# Altium schematic sheet VESC_KS75600_ana_con.SchDoc
size A2; SheetNumber: 1; SheetTotal: 4
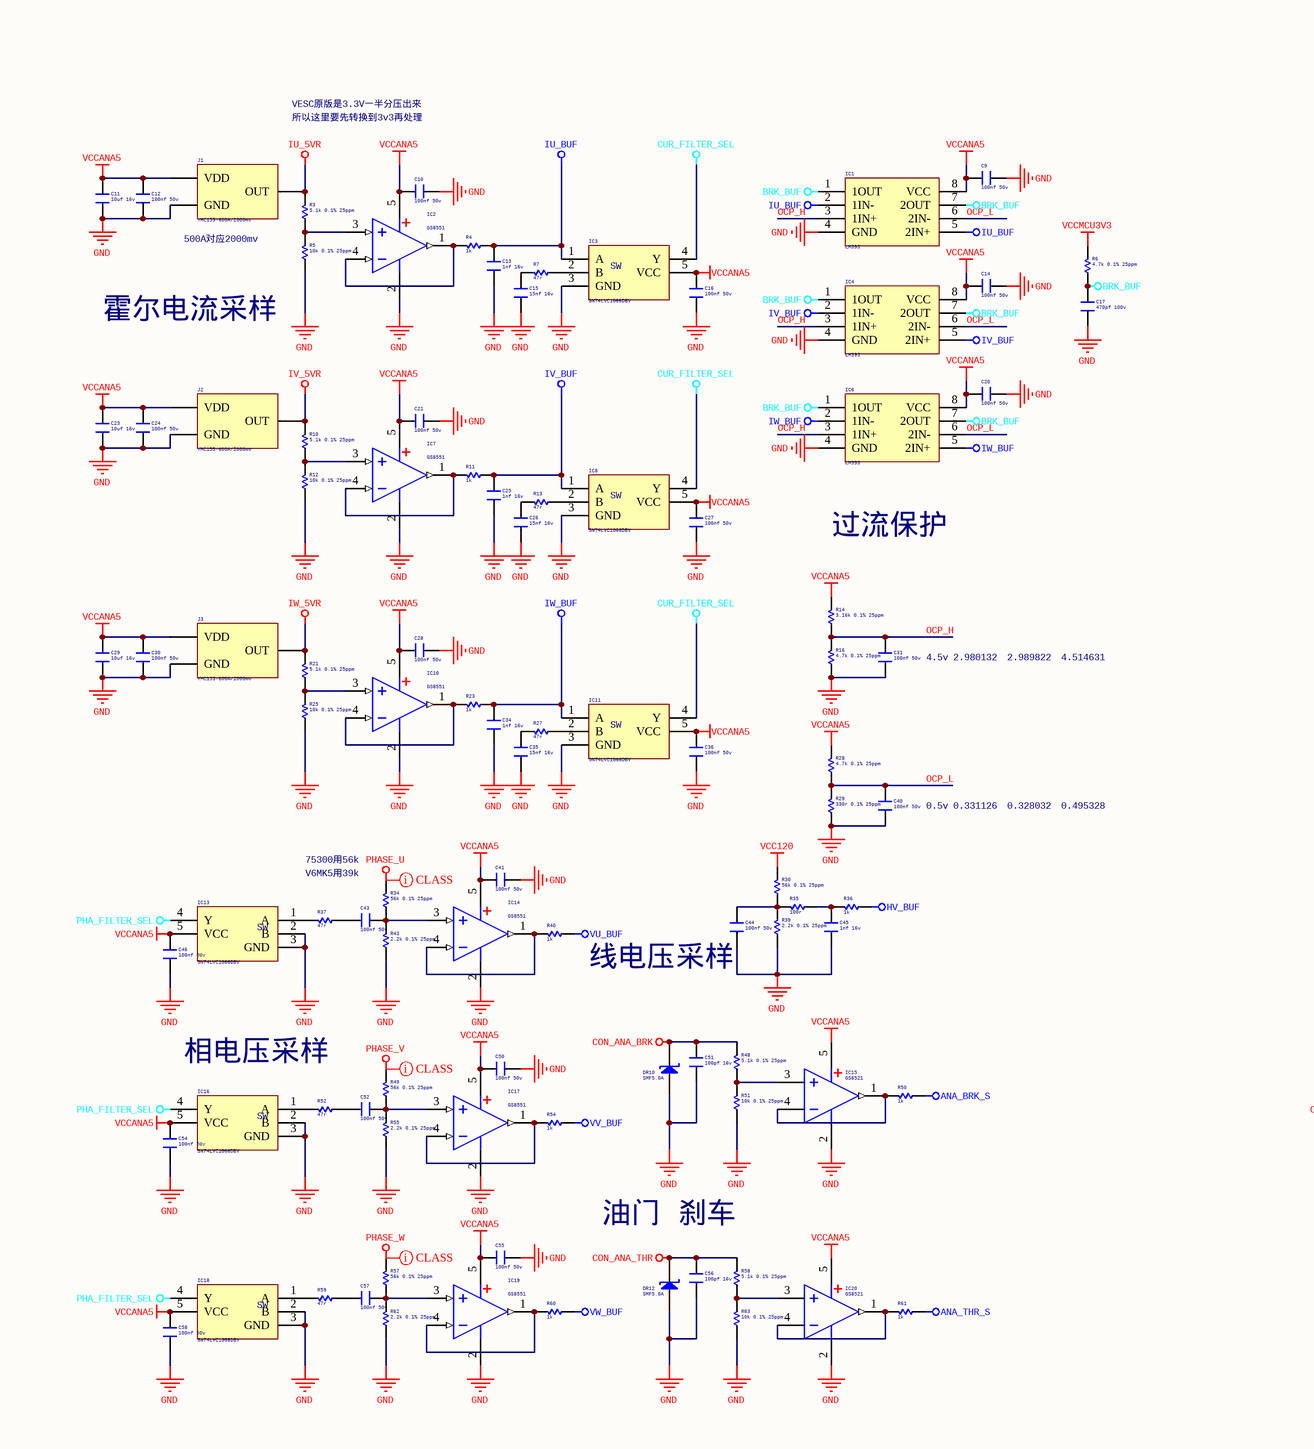
[diagram p0: VESC_KS75600_ana_con.SchDoc, left]
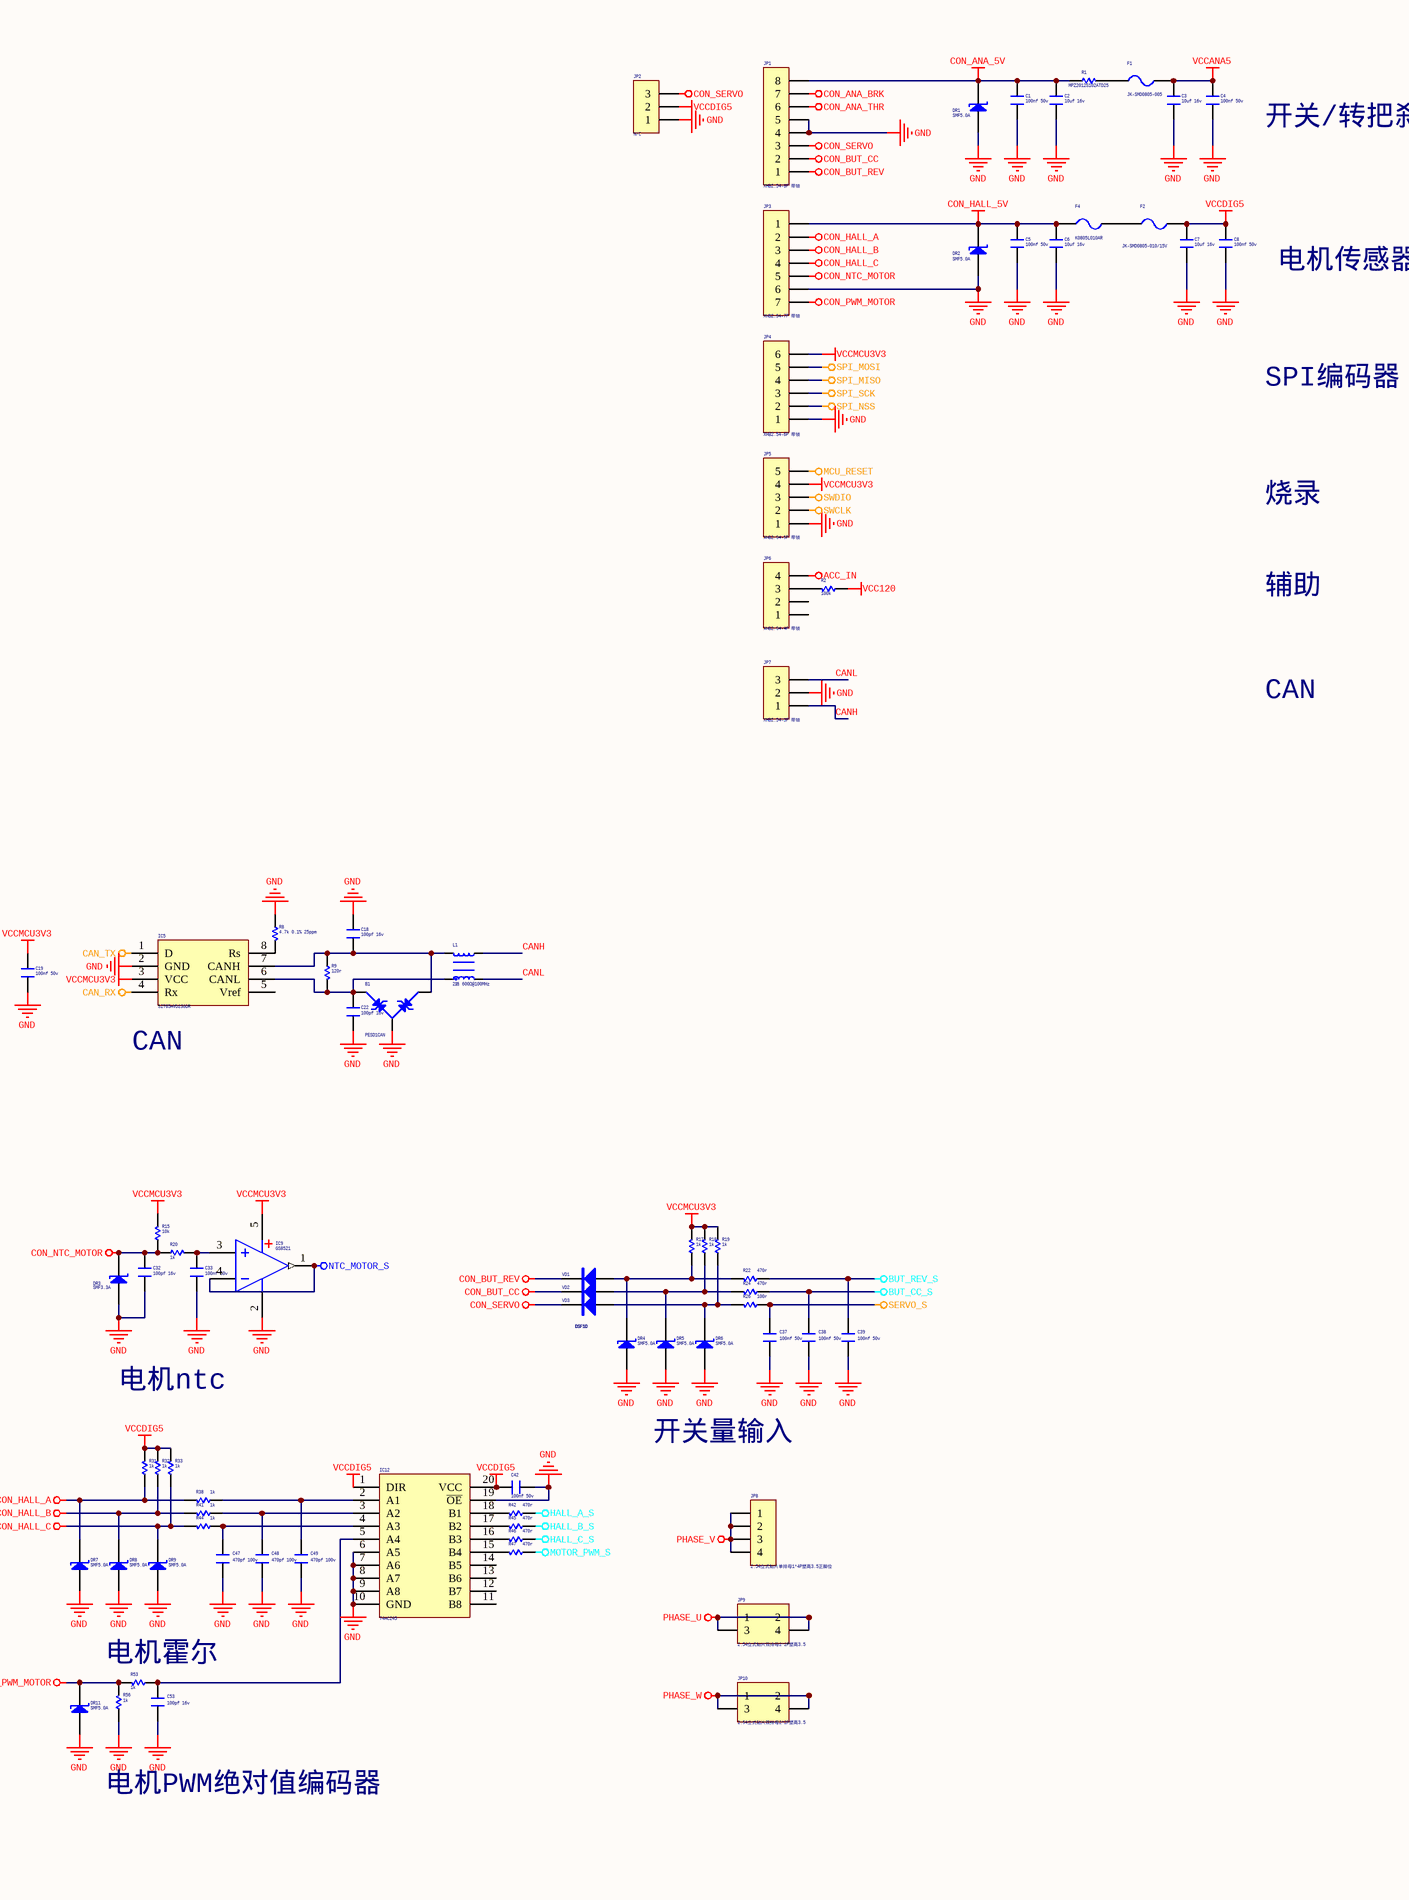
[diagram p1: VESC_KS75600_ana_con.SchDoc, right]

## Parts
B1  PESD1CAN  [SOT23-3L]
C1  100nf 50v  [C 0603]
C2  10uf 16v  [C 0805]
C3  10uf 16v  [C 0805]
C4  100nf 50v  [C 0603]
C5  100nf 50v  [C 0603]
C6  10uf 16v  [C 0805]
C7  10uf 16v  [C 0805]
C8  100nf 50v  [C 0603]
C9  100nf 50v  [C 0603]
C10  100nf 50v  [C 0603]
C11  10uf 16v  [C 0805]
C12  100nf 50v  [C 0603]
C13  1nf 16v  [C 0603]
C14  100nf 50v  [C 0603]
C15  15nf 16v  [C 0603]
C16  100nf 50v  [C 0603]
C17  470pf 100v  [C 0805]
C18  100pf 16v  [C 0603]
C19  100nf 50v  [C 0603]
C20  100nf 50v  [C 0603]
C21  100nf 50v  [C 0603]
C22  100pf 16v  [C 0603]
C23  10uf 16v  [C 0805]
C24  100nf 50v  [C 0603]
C25  1nf 16v  [C 0603]
C26  15nf 16v  [C 0603]
C27  100nf 50v  [C 0603]
C28  100nf 50v  [C 0603]
C29  10uf 16v  [C 0805]
C30  100nf 50v  [C 0603]
C31  100nf 50v  [C 0603]
C32  100pf 16v  [C 0603]
C33  100nf 50v  [C 0603]
C34  1nf 16v  [C 0603]
C35  15nf 16v  [C 0603]
C36  100nf 50v  [C 0603]
C37  100nf 50v  [C 0805]
C38  100nf 50v  [C 0805]
C39  100nf 50v  [C 0805]
C40  100nf 50v  [C 0603]
C41  100nf 50v  [C 0603]
C42  100nf 50v  [C 0603]
C43  100nf 50v  [C 0805]
C44  100nf 50v  [C 0805]
C45  1nf 16v  [C 0603]
C46  100nf 50v  [C 0603]
C47  470pf 100v  [C 0805]
C48  470pf 100v  [C 0805]
C49  470pf 100v  [C 0805]
C50  100nf 50v  [C 0603]
C51  100pf 16v  [C 0603]
C52  100nf 50v  [C 0805]
C53  100pf 16v  [C 0805]
C54  100nf 50v  [C 0603]
C55  100nf 50v  [C 0603]
C56  100pf 16v  [C 0603]
C57  100nf 50v  [C 0805]
C58  100nf 50v  [C 0603]
DR1  SMF5.0A  [SOD-123F]
DR2  SMF5.0A  [SOD-123F]
DR3  SMF3.3A  [SOD-123F]
DR4  SMF5.0A  [SOD-123F]
DR5  SMF5.0A  [SOD-123F]
DR6  SMF5.0A  [SOD-123F]
DR7  SMF5.0A  [SOD-123F]
DR8  SMF5.0A  [SOD-123F]
DR9  SMF5.0A  [SOD-123F]
DR10  SMF5.0A  [SOD-123F]
DR11  SMF5.0A  [SOD-123F]
DR12  SMF5.0A  [SOD-123F]
F1  JK-SMD0805-005  [FU 0805]
F2  JK-SMD0805-010/15V  [FU 0805]
F4  K0805L010AR  [FU 0805]
IC1  LM393  [SOP8_N]
IC2  GS8551  [SOT23-5L]
IC3  SN74LVC1G66DBV  [SOT23-5N]
IC4  LM393  [SOP8_N]
IC5  SIT65HVD230DR  [SOP8_N]
IC6  LM393  [SOP8_N]
IC7  GS8551  [SOT23-5L]
IC8  SN74LVC1G66DBV  [SOT23-5N]
IC9  GS8521  [SOT23-5N]
IC10  GS8551  [SOT23-5L]
IC11  SN74LVC1G66DBV  [SOT23-5N]
IC12  74HC245  [TSSOP20_N]
IC13  SN74LVC1G66DBV  [SOT23-5N]
IC14  GS8551  [SOT23-5L]
IC15  GS8521  [SOT23-5N]
IC16  SN74LVC1G66DBV  [SOT23-5N]
IC17  GS8551  [SOT23-5L]
IC18  SN74LVC1G66DBV  [SOT23-5N]
IC19  GS8551  [SOT23-5L]
IC20  GS8521  [SOT23-5N]
J1  YMC15S-600A/2000mv  [YMC15S]
J2  YMC15S-600A/2000mv  [YMC15S]
J3  YMC15S-600A/2000mv  [YMC15S]
JP1  XHB2.54-8P 带锁  [XH2.54-8P]
JP2  N/C  [HDR-1X3]
JP3  XHB2.54-7P 带锁  [XH2.54-7P]
JP4  XHB2.54-6P 带锁  [XH2.54-6P]
JP5  XHB2.54-5P 带锁  [XH2.54-5P]
JP6  XHB2.54-4P 带锁  [XH2.54-4P]
JP7  XHB2.54-3P 带锁  [XH2.54-3P]
JP8  2.54立式贴片单排母1*4P塑高3.5正脚位  [2.54立贴错位排母 4P]
JP9  2.54立式贴片双排母2*2P塑高3.5  [贴片2.54双排母 pcb开孔]
JP10  2.54立式贴片双排母2*2P塑高3.5  [贴片2.54双排母 pcb开孔]
L1  2路 600Ω@100MHz  [D_C_C_1206]
R1  MPZ2012S102ATD25  [R 0805]
R2  100k  [R 0805]
R3  5.1k 0.1% 25ppm  [R 0805-HP]
R4  1k  [R 0603]
R5  10k 0.1% 25ppm  [R 0805-HP]
R6  4.7k 0.1% 25ppm  [R 0805]
R7  47r  [R 0603]
R8  4.7k 0.1% 25ppm  [R 0805]
R9  120r  [R 0603]
R10  5.1k 0.1% 25ppm  [R 0805-HP]
R11  1k  [R 0603]
R12  10k 0.1% 25ppm  [R 0805-HP]
R13  47r  [R 0603]
R14  3.16k 0.1% 25ppm  [R 0805-HP]
R15  10k  [R 0603]
R16  4.7k 0.1% 25ppm  [R 0805]
R17  1k  [R 0603]
R18  1k  [R 0603]
R19  1k  [R 0603]
R20  1k  [R 0603]
R21  5.1k 0.1% 25ppm  [R 0805-HP]
R22  470r  [R 0603]
R23  1k  [R 0603]
R24  470r  [R 0603]
R25  10k 0.1% 25ppm  [R 0805-HP]
R26  100r  [R 0603]
R27  47r  [R 0603]
R28  4.7k 0.1% 25ppm  [R 0805]
R29  330r 0.1% 25ppm  [R 0805-HP]
R30  56k 0.1% 25ppm  [R 0805-HP]
R31  1k  [R 0603]
R32  1k  [R 0603]
R33  1k  [R 0603]
R34  56k 0.1% 25ppm  [R 0805-HP]
R35  100r  [R 0603]
R36  1k  [R 0603]
R37  47r  [R 0603]
R38  1k  [R 0603]
R39  2.2k 0.1% 25ppm  [R 0805-HP]
R40  1k  [R 0603]
R41  1k  [R 0603]
R42  470r  [R 0603]
R43  2.2k 0.1% 25ppm  [R 0805-HP]
R44  1k  [R 0603]
R45  470r  [R 0603]
R46  470r  [R 0603]
R47  470r  [R 0603]
R48  5.1k 0.1% 25ppm  [R 0805-HP]
R49  56k 0.1% 25ppm  [R 0805-HP]
R50  1k  [R 0603]
R51  10k 0.1% 25ppm  [R 0805-HP]
R52  47r  [R 0603]
R53  1k  [R 0603]
R54  1k  [R 0603]
R55  2.2k 0.1% 25ppm  [R 0805-HP]
R56  1k  [R 0603]
R57  56k 0.1% 25ppm  [R 0805-HP]
R58  5.1k 0.1% 25ppm  [R 0805-HP]
R59  47r  [R 0603]
R60  1k  [R 0603]
R61  1k  [R 0603]
R62  2.2k 0.1% 25ppm  [R 0805-HP]
R63  10k 0.1% 25ppm  [R 0805-HP]
VD1  DSF1D  [SOD-123]
VD2  DSF1D  [SOD-123]
VD3  DSF1D  [SOD-123]

## Nets
ACC_IN: JP6.4
ANA_BRK_S: R50.1
ANA_THR_S: R61.1
BRK_BUF: C17.1 IC1.1(1OUT) IC1.7(2OUT) IC4.1(1OUT) IC4.7(2OUT) IC6.1(1OUT) IC6.7(2OUT) R6.1
BUT_CC_S: C38.2 R24.1
BUT_REV_S: C39.2 R22.1
CAN_RX: IC5.4(Rx)
CAN_TX: IC5.1(D)
CON_ANA_5V: C1.1 C2.1 DR1.2(K) JP1.8 R1.1
CON_ANA_BRK: C51.2 DR10.2(K) JP1.7 R48.2
CON_ANA_THR: C56.2 DR12.2(K) JP1.6 R58.2
CON_BUT_CC: JP1.2 VD2.2(K)
CON_BUT_REV: JP1.1 VD1.2(K)
CON_HALL_5V: C5.1 C6.1 DR2.2(K) F4.2 JP3.1
CON_HALL_A: DR7.2(K) JP3.2 R31.1 R38.2
CON_HALL_B: DR8.2(K) JP3.3 R32.1 R41.2
CON_HALL_C: DR9.2(K) JP3.4 R33.1 R44.2
CON_NTC_MOTOR: C32.2 DR3.2(K) JP3.5 R15.1 R20.1
CON_PWM_MOTOR: DR11.2(K) JP3.7 R53.2 R56.2
CON_SERVO: JP1.3 JP2.3 VD3.2(K)
CUR_FILTER_SEL: IC3.4(Y) IC8.4(Y) IC11.4(Y)
GND: B1.3 C1.2 C2.2 C3.2 C4.2 C5.2 C6.2 C7.2 C8.2 C9.2 C10.2 C11.1 C12.2 C13.2 C14.2 C15.2 C16.2 C17.2 C18.2 C19.2 C20.2 C21.2 C22.1 C23.1 C24.2 C25.2 C26.2 C27.2 C28.2 C29.1 C30.2 C31.1 C32.1 C33.1 C34.2 C35.2 C36.2 C37.1 C38.1 C39.1 C40.1 C41.2 C42.2 C44.2 C45.2 C46.2 C47.1 C48.1 C49.1 C50.2 C51.1 C53.1 C54.2 C55.2 C56.1 C58.2 DR1.1(A) DR2.1(A) DR3.1(A) DR4.1(A) DR5.1(A) DR6.1(A) DR7.1(A) DR8.1(A) DR9.1(A) DR10.1(A) DR11.1(A) DR12.1(A) IC1.4(GND) IC2.2(V-) IC3.3(GND) IC4.4(GND) IC5.2(GND) IC6.4(GND) IC7.2(V-) IC8.3(GND) IC9.2(V-) IC10.2(V-) IC11.3(GND) IC12.6(A5) IC12.7(A6) IC12.8(A7) IC12.9(A8) IC12.10(GND) IC12.19(~{OE}) IC13.2(B) IC13.3(GND) IC14.2(V-) IC15.2(V-) IC16.2(B) IC16.3(GND) IC17.2(V-) IC18.2(B) IC18.3(GND) IC19.2(V-) IC20.2(V-) J1.2(GND) J2.2(GND) J3.2(GND) JP1.4 JP1.5 JP2.1 JP3.6 JP4.1 JP5.1 JP7.2 R5.1 R8.1 R12.1 R16.1 R25.1 R29.1 R39.1 R43.1 R51.1 R55.1 R56.1 R62.1 R63.1
HALL_A_S: R42.1
HALL_B_S: R45.1
HALL_C_S: R46.1
HV_BUF: R36.1
IU_5VR: J1.3(OUT) R3.2
IU_BUF: C13.1 IC1.2(1IN-) IC1.5(2IN+) IC3.1(A) R4.1
IV_5VR: J2.3(OUT) R10.2
IV_BUF: C25.1 IC4.2(1IN-) IC4.5(2IN+) IC8.1(A) R11.1
IW_5VR: J3.3(OUT) R21.2
IW_BUF: C34.1 IC6.2(1IN-) IC6.5(2IN+) IC11.1(A) R23.1
MCU_RESET: JP5.5
MOTOR_PWM_S: R47.1
NTC_MOTOR_S: IC9.1(OUT) IC9.4(IN-)
PHA_FILTER_SEL: IC13.4(Y) IC16.4(Y) IC18.4(Y)
PHASE_U: JP9.1 JP9.2 JP9.3 JP9.4 R34.2
PHASE_V: JP8.1 JP8.2 JP8.3 JP8.4 R49.2
PHASE_W: JP10.1 JP10.2 JP10.3 JP10.4 R57.2
SERVO_S: C37.2 R26.1
SPI_MISO: JP4.4
SPI_MOSI: JP4.5
SPI_NSS: JP4.2
SPI_SCK: JP4.3
SWCLK: JP5.2
SWDIO: JP5.3
VCC120: R2.1 R30.2
VCCANA5: C3.1 C4.1 C9.1 C10.1 C11.2 C12.1 C14.1 C16.1 C20.1 C21.1 C23.2 C24.1 C27.1 C28.1 C29.2 C30.1 C36.1 C41.1 C46.1 C50.1 C54.1 C55.1 C58.1 F1.1 IC1.8(VCC) IC2.5(V+) IC3.5(VCC) IC4.8(VCC) IC6.8(VCC) IC7.5(V+) IC8.5(VCC) IC10.5(V+) IC11.5(VCC) IC13.5(VCC) IC14.5(V+) IC15.5(V+) IC16.5(VCC) IC17.5(V+) IC18.5(VCC) IC19.5(V+) IC20.5(V+) J1.1(VDD) J2.1(VDD) J3.1(VDD) R14.2 R28.2
VCCDIG5: C7.1 C8.1 C42.1 F2.1 IC12.1(DIR) IC12.20(VCC) JP2.2 R31.2 R32.2 R33.2
VCCMCU3V3: C19.1 IC5.3(VCC) IC9.5(V+) JP4.6 JP5.4 R6.2 R15.2 R17.2 R18.2 R19.2
VU_BUF: R40.1
VV_BUF: R54.1
VW_BUF: R60.1
CANH: JP7.1 L1.3
CANL: JP7.3 L1.2
OCP_H: C31.2 IC1.3(1IN+) IC4.3(1IN+) IC6.3(1IN+) R14.1 R16.2
OCP_L: C40.2 IC1.6(2IN-) IC4.6(2IN-) IC6.6(2IN-) R28.1 R29.2
NetB1_1: B1.1 C18.1 IC5.7(CANH) L1.4 R9.1
NetB1_2: B1.2 C22.2 IC5.6(CANL) L1.1 R9.2
NetC15_1: C15.1 R7.2
NetC26_1: C26.1 R13.2
NetC33_2: C33.2 IC9.3(IN+) R20.2
NetC35_1: C35.1 R27.2
NetC43_1: C43.1 R37.1
NetC43_2: C43.2 IC14.3(IN+) R34.1 R43.2
NetC44_1: C44.1 R30.1 R35.2 R39.2
NetC45_1: C45.1 R35.1 R36.2
NetC47_2: C47.2 IC12.4(A3) R44.1
NetC48_2: C48.2 IC12.3(A2) R41.1
NetC49_2: C49.2 IC12.2(A1) R38.1
NetC52_1: C52.1 R52.1
NetC52_2: C52.2 IC17.3(IN+) R49.1 R55.2
NetC53_2: C53.2 IC12.5(A4) R53.1
NetC57_1: C57.1 R59.1
NetC57_2: C57.2 IC19.3(IN+) R57.1 R62.2
NetDR4_2: DR4.2(K) R17.1 R22.2 VD1.1(A)
NetDR5_2: DR5.2(K) R18.1 R24.2 VD2.1(A)
NetDR6_2: DR6.2(K) R19.1 R26.2 VD3.1(A)
NetF1_2: F1.2 R1.2
NetF2_2: F2.2 F4.1
NetIC2_1: IC2.1(OUT) IC2.4(IN-) R4.2
NetIC2_3: IC2.3(IN+) R3.1 R5.2
NetIC3_2: IC3.2(B) R7.1
NetIC5_8: IC5.8(Rs) R8.2
NetIC7_1: IC7.1(OUT) IC7.4(IN-) R11.2
NetIC7_3: IC7.3(IN+) R10.1 R12.2
NetIC8_2: IC8.2(B) R13.1
NetIC10_1: IC10.1(OUT) IC10.4(IN-) R23.2
NetIC10_3: IC10.3(IN+) R21.1 R25.2
NetIC11_2: IC11.2(B) R27.1
NetIC12_15: IC12.15(B4) R47.2
NetIC12_16: IC12.16(B3) R46.2
NetIC12_17: IC12.17(B2) R45.2
NetIC12_18: IC12.18(B1) R42.2
NetIC13_1: IC13.1(A) R37.2
NetIC14_1: IC14.1(OUT) IC14.4(IN-) R40.2
NetIC15_1: IC15.1(OUT) IC15.4(IN-) R50.2
NetIC15_3: IC15.3(IN+) R48.1 R51.2
NetIC16_1: IC16.1(A) R52.2
NetIC17_1: IC17.1(OUT) IC17.4(IN-) R54.2
NetIC18_1: IC18.1(A) R59.2
NetIC19_1: IC19.1(OUT) IC19.4(IN-) R60.2
NetIC20_1: IC20.1(OUT) IC20.4(IN-) R61.2
NetIC20_3: IC20.3(IN+) R58.1 R63.2
NetJP6_3: JP6.3 R2.2

Not connected (* = marked no-connect by the designer): IC5 5(Vref); IC12 11(B8) 12(B7) 13(B6) 14(B5); JP6 1 2

## Layout directives
net class 相线: PHASE_U, PHASE_V, PHASE_W

## Notes on the sheet
- 开关/转把刹车
- 电机传感器
- SPI编码器
- 烧录
- 辅助
- VESC原版是3.3V一半分压出来
- 所以这里要先转换到3v3再处理
- CAN
- (near J1) 500A对应2000mv
- 霍尔电流采样
- (near IC5) CAN
- 过流保护
- (near C31) 4.5v
- 2.980132
- 2.989822
- 4.514631
- (near C40) 0.5v
- 0.331126
- 0.328032
- 0.495328
- 电机ntc
- 75300用56k
- V6MK5用39k
- 开关量输入
- (near R40) 线电压采样
- (near IC16) 相电压采样
- (near R53) 电机霍尔
- 油门 刹车
- 电机PWM绝对值编码器
- (in symbol SN74LVC1G66) SW

## Library data of the parts
B1 = SM712: 7V+12V 双向双路TVS
C1-C58 = C: 无极性贴片电容
  C1 C4 C5 C8-C10 C12 C14 C16 C19-C21 C24 C27 C28 C30 C31 C33 C36-C44 C46 C50 C52 C54 C55 C57 C58: Voltage: 50v; Value: 100nf
  C2 C3 C6 C7 C11 C23 C29: Voltage: 16v; Value: 10uf
  C13 C25 C34 C45: Voltage: 16v; Value: 1nf
  C15 C26 C35: Voltage: 16v; Value: 15nf
  C17 C47-C49: Voltage: 100v; Value: 470pf
  C18 C22 C32 C51 C53 C56: Voltage: 16v; Value: 100pf
DR1-DR12 = DR_S: 瞬态电压抑制二极管(单向)
F1 F2 F4 = FU: 贴片保险丝
IC1 IC4 IC6 = LM393_A: 双路电压比较
IC2 IC7 IC9 IC10 IC14 IC15 IC17 IC19 IC20 = GS8331: 单运放 SOT23-5
IC3 IC8 IC11 IC13 IC16 IC18 = SN74LVC1G66: 单路常开模拟开关 0.5ns 5.5Ω
IC5 = SN65HVD230: CAN芯片
IC12 = 74HC245: 八线收发器
J1-J3 = YMC15S: 源弥科技 开环霍尔传感器
JP1 = Header 8: 8P接插件
JP2 JP7 = Header 3: 3P接插件
JP3 = Header 7: 7P接插件
JP4 = Header 6: 6P接插件
JP5 = Header 5: 5P接插件
JP6 JP8 = Header 4: 4P接插件
JP9 JP10 = Header 2X2: 2*2P接插件
L1 = L-CMC: 共模电感; Value: 2路 600Ω@100MHz
R1-R63 = R: 贴片电阻
  R1: Value: MPZ2012S102ATD25
  R2: Value: 100k
  R3 R10 R21 R48 R58: Value: 5.1k 0.1% 25ppm
  R4 R11 R17-R20 R23 R31-R33 R36 R38 R40 R41 R44 R50 R53 R54 R56 R60 R61: Value: 1k
  R5 R12 R25 R51 R63: Value: 10k 0.1% 25ppm
  R6 R8 R16 R28: Value: 4.7k 0.1% 25ppm
  R7 R13 R27 R37 R52 R59: Value: 47r
  R9: Value: 120r
  R14: Value: 3.16k 0.1% 25ppm
  R15: Value: 10k
  R22 R24 R42 R45-R47: Value: 470r
  R26 R35: Value: 100r
  R29: Value: 330r 0.1% 25ppm
  R30 R34 R49 R57: Value: 56k 0.1% 25ppm
  R39 R43 R55 R62: Value: 2.2k 0.1% 25ppm
VD1-VD3 = SR540: 肖特基二极管